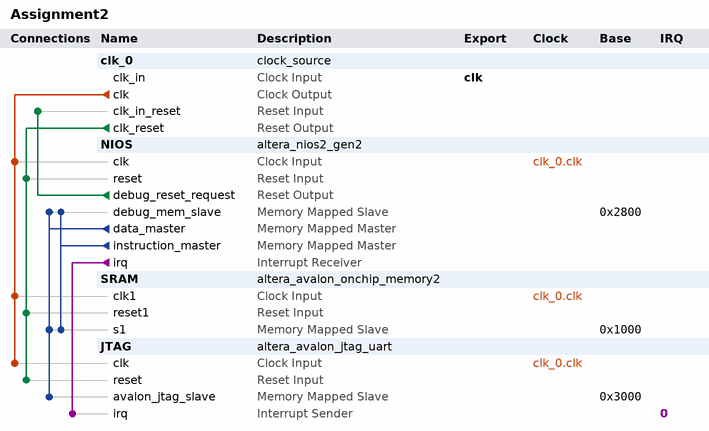
[diagram p0: system contents]
# Platform Designer (Qsys) system Assignment2, MAX 10 10M50DAF484C6GES
# Parameters at their usual value, and those the tool derives, are not listed.
package require -exact qsys 17.1
create_system Assignment2
set_project_property DEVICE_FAMILY {MAX 10}
set_project_property DEVICE 10M50DAF484C6GES

add_instance clk_0 clock_source 17.1
set_instance_parameter_value clk_0 clockFrequency 50000000

add_instance NIOS altera_nios2_gen2 17.1
set_instance_parameter_value NIOS dcache_size 2048
set_instance_parameter_value NIOS exceptionSlave SRAM.s1
set_instance_parameter_value NIOS icache_size 4096
set_instance_parameter_value NIOS impl Tiny
set_instance_parameter_value NIOS resetSlave SRAM.s1

add_instance SRAM altera_avalon_onchip_memory2 17.1
set_instance_parameter_value SRAM dataWidth 32
set_instance_parameter_value SRAM dualPort false
set_instance_parameter_value SRAM initMemContent true
set_instance_parameter_value SRAM initializationFileName onchip_mem.hex
set_instance_parameter_value SRAM memorySize 4096

add_instance JTAG altera_avalon_jtag_uart 17.1
set_instance_parameter_value JTAG simInteractiveOptions NO_INTERACTIVE_WINDOWS

# connections
add_connection clk_0.clk JTAG.clk clock
add_connection clk_0.clk NIOS.clk clock
add_connection clk_0.clk SRAM.clk1 clock
add_connection clk_0.clk_reset JTAG.reset reset
add_connection clk_0.clk_reset NIOS.reset reset
add_connection clk_0.clk_reset SRAM.reset1 reset
add_connection NIOS.debug_reset_request clk_0.clk_in_reset reset
add_connection NIOS.data_master JTAG.avalon_jtag_slave avalon
set_connection_parameter_value NIOS.data_master/JTAG.avalon_jtag_slave baseAddress 0x3000
add_connection NIOS.data_master NIOS.debug_mem_slave avalon
set_connection_parameter_value NIOS.data_master/NIOS.debug_mem_slave baseAddress 0x2800
add_connection NIOS.data_master SRAM.s1 avalon
set_connection_parameter_value NIOS.data_master/SRAM.s1 baseAddress 0x1000
add_connection NIOS.instruction_master NIOS.debug_mem_slave avalon
set_connection_parameter_value NIOS.instruction_master/NIOS.debug_mem_slave baseAddress 0x2800
add_connection NIOS.instruction_master SRAM.s1 avalon
set_connection_parameter_value NIOS.instruction_master/SRAM.s1 baseAddress 0x1000
add_connection NIOS.irq JTAG.irq interrupt
set_connection_parameter_value NIOS.irq/JTAG.irq irqNumber 0

# exported interfaces
add_interface clk clock sink
set_interface_property clk EXPORT_OF clk_0.clk_in

set_interconnect_requirement {$system} qsys_mm.clockCrossingAdapter HANDSHAKE
set_interconnect_requirement {$system} qsys_mm.enableEccProtection FALSE
set_interconnect_requirement {$system} qsys_mm.insertDefaultSlave FALSE
set_interconnect_requirement {$system} qsys_mm.maxAdditionalLatency 1

save_system Assignment2.qsys
